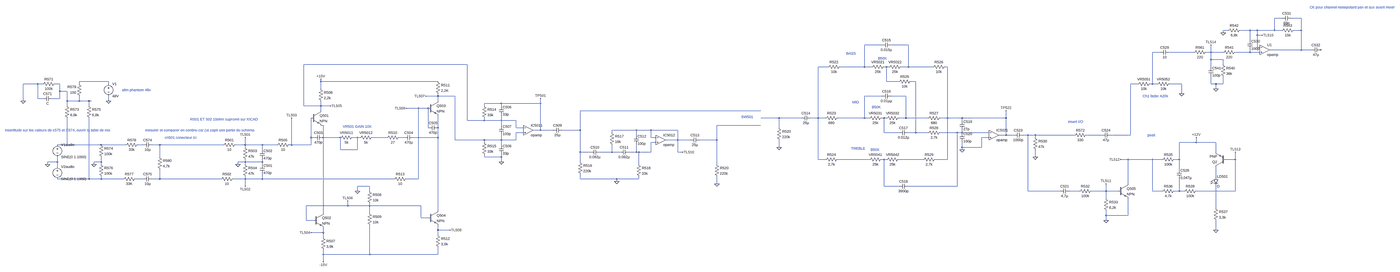
[diagram p0: schematic channelsimu.asc, whole sheet]
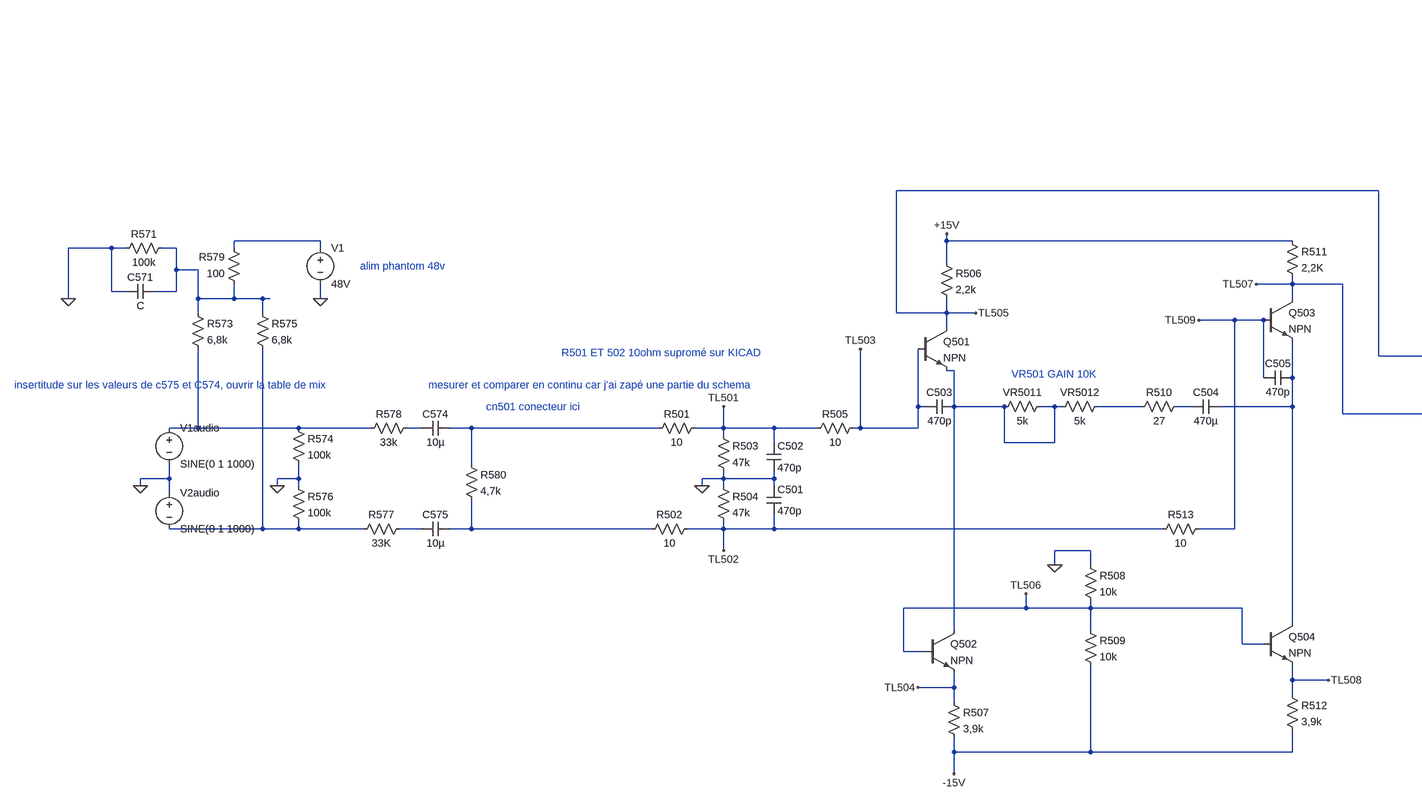
[diagram p1: schematic channelsimu.asc, part, row 1 of 1, column 1 of 3]
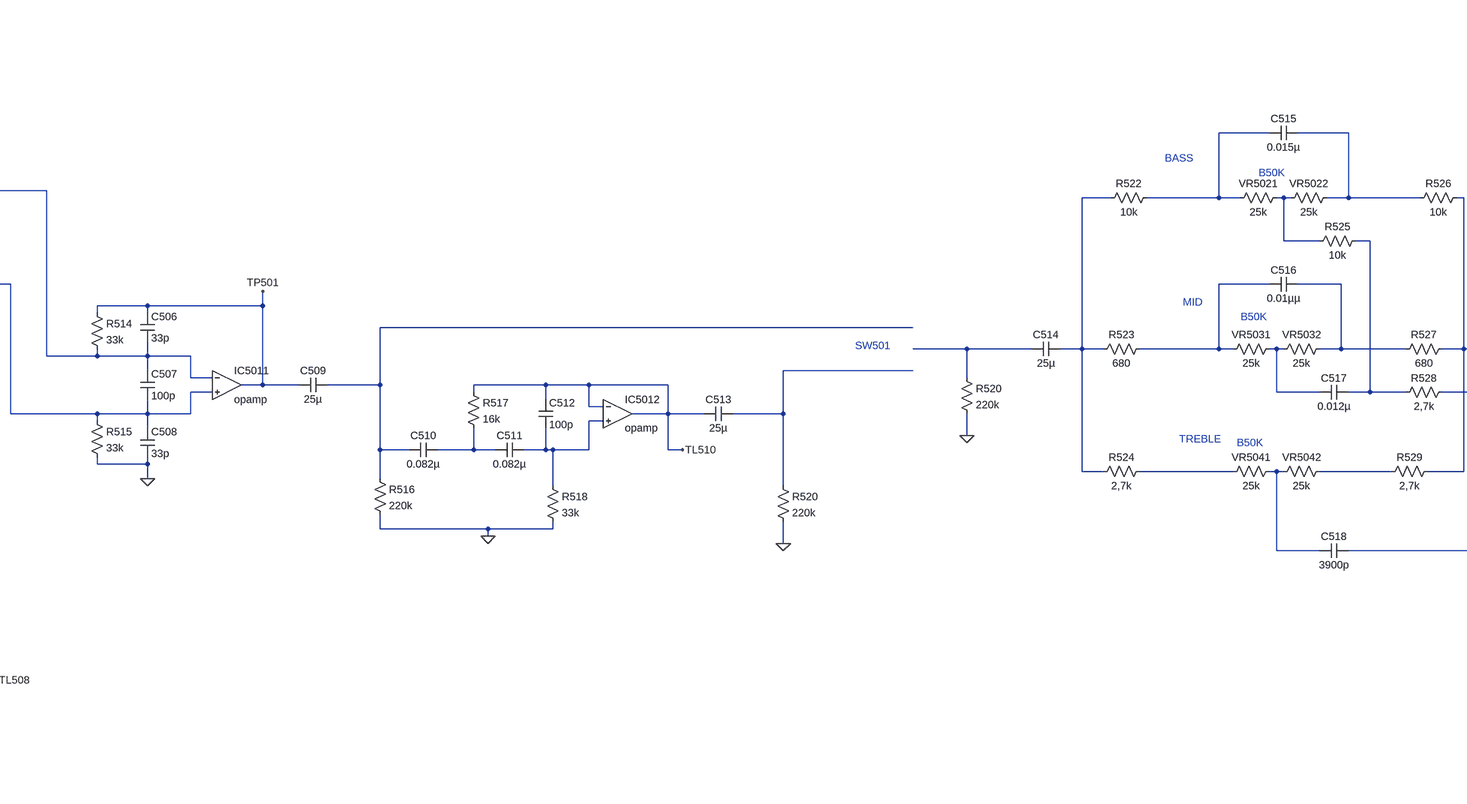
[diagram p2: schematic channelsimu.asc, part, row 1 of 1, column 2 of 3]
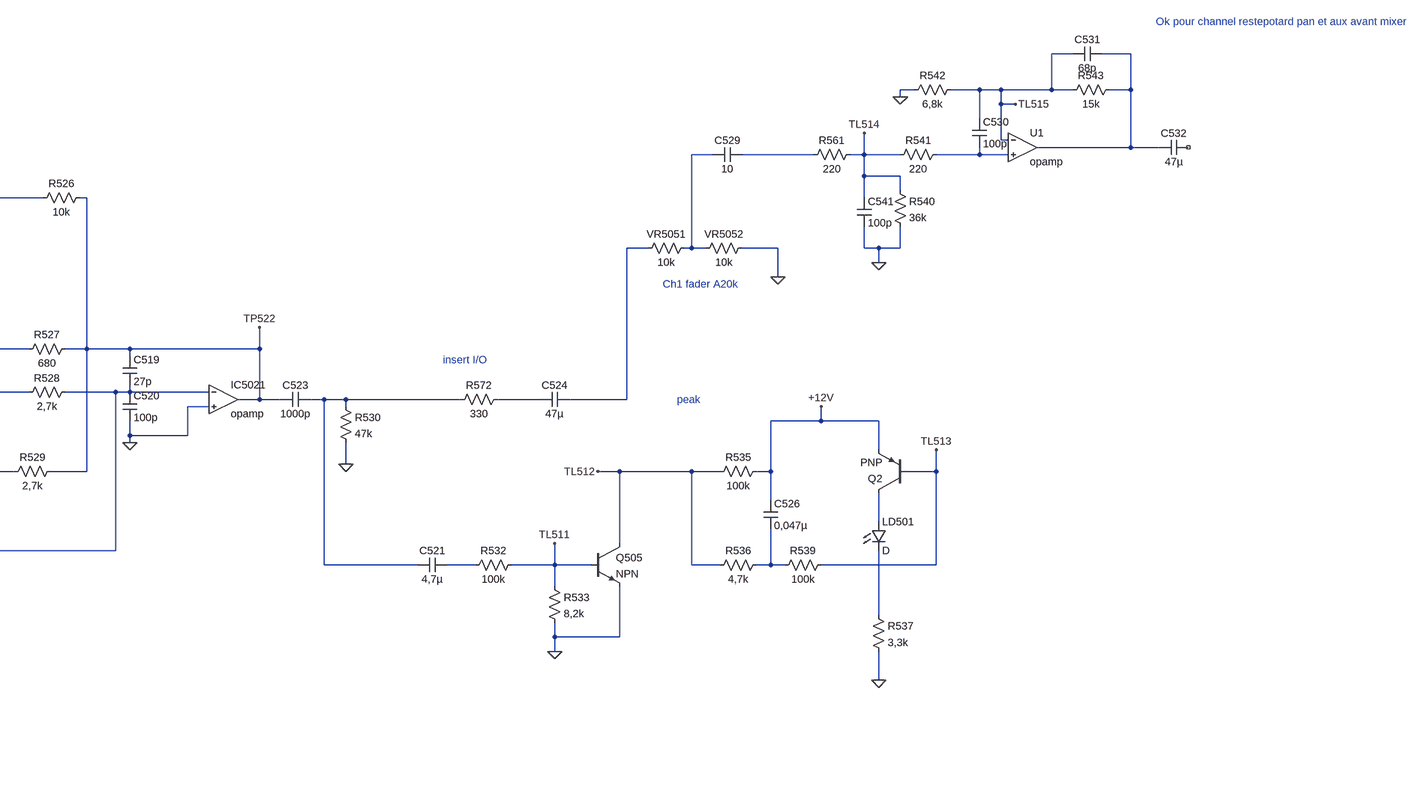
[diagram p3: schematic channelsimu.asc, part, row 1 of 1, column 3 of 3]
channelsimu.asc, the LTspice schematic file:
Version 4
SHEET 1 9212 964
WIRE 8416 -736 8368 -736
WIRE 8544 -736 8480 -736
WIRE 8064 -656 8032 -656
WIRE 8208 -656 8144 -656
WIRE 8256 -656 8208 -656
WIRE 8368 -656 8368 -736
WIRE 8368 -656 8256 -656
WIRE 8416 -656 8368 -656
WIRE 8544 -656 8544 -736
WIRE 8544 -656 8496 -656
WIRE 8032 -640 8032 -656
WIRE 8256 -624 8256 -656
WIRE 8288 -624 8256 -624
WIRE 8208 -592 8208 -656
WIRE 5792 -560 5680 -560
WIRE 5968 -560 5856 -560
WIRE 8256 -544 8256 -624
WIRE 8272 -544 8256 -544
WIRE 8544 -528 8544 -656
WIRE 8544 -528 8336 -528
WIRE 8608 -528 8544 -528
WIRE 7616 -512 7568 -512
WIRE 7840 -512 7680 -512
WIRE 7952 -512 7952 -560
WIRE 7952 -512 7920 -512
WIRE 8032 -512 7952 -512
WIRE 8208 -512 8208 -528
WIRE 8208 -512 8112 -512
WIRE 8272 -512 8208 -512
WIRE 7952 -464 7952 -512
WIRE 8032 -464 7952 -464
WIRE 2672 -432 1600 -432
WIRE 8032 -432 8032 -464
WIRE 5440 -416 5376 -416
WIRE 5680 -416 5680 -560
WIRE 5680 -416 5520 -416
WIRE 5728 -416 5680 -416
WIRE 5824 -416 5808 -416
WIRE 5840 -416 5824 -416
WIRE 5968 -416 5968 -560
WIRE 5968 -416 5920 -416
WIRE 6128 -416 5968 -416
WIRE 6224 -416 6208 -416
WIRE 7952 -416 7952 -464
WIRE 320 -320 128 -320
WIRE 1712 -320 1712 -336
WIRE 2480 -320 1712 -320
WIRE 5824 -320 5824 -416
WIRE 5904 -320 5824 -320
WIRE 6016 -320 5984 -320
WIRE -144 -304 -240 -304
WIRE -112 -304 -144 -304
WIRE 0 -304 -32 -304
WIRE 128 -304 128 -320
WIRE 320 -304 320 -320
WIRE 7472 -304 7424 -304
WIRE 7568 -304 7568 -512
WIRE 7568 -304 7552 -304
WIRE 7600 -304 7568 -304
WIRE 7760 -304 7680 -304
WIRE 7952 -304 7952 -352
WIRE 7984 -304 7952 -304
WIRE 8032 -304 8032 -352
WIRE 8032 -304 7984 -304
WIRE 1712 -272 1712 -320
WIRE 7984 -272 7984 -304
WIRE 0 -256 0 -304
WIRE 48 -256 0 -256
WIRE 7760 -240 7760 -304
WIRE 2480 -224 2480 -240
WIRE 2480 -224 2400 -224
WIRE 2592 -224 2480 -224
WIRE 5792 -224 5680 -224
WIRE 5952 -224 5856 -224
WIRE -144 -208 -144 -304
WIRE -112 -208 -144 -208
WIRE 0 -208 0 -256
WIRE 0 -208 -48 -208
WIRE -240 -192 -240 -304
WIRE 48 -192 48 -256
WIRE 128 -192 128 -224
WIRE 128 -192 48 -192
WIRE 192 -192 128 -192
WIRE 208 -192 192 -192
WIRE 320 -192 320 -224
WIRE 2480 -192 2480 -224
WIRE 2896 -176 2784 -176
WIRE 3152 -176 3152 -208
WIRE 3152 -176 2896 -176
WIRE 48 -160 48 -192
WIRE 192 -160 192 -192
WIRE 1600 -160 1600 -432
WIRE 1712 -160 1712 -192
WIRE 1712 -160 1600 -160
WIRE 1776 -160 1712 -160
WIRE 2784 -160 2784 -176
WIRE 2896 -160 2896 -176
WIRE 2352 -144 2272 -144
WIRE 2416 -144 2352 -144
WIRE 1712 -128 1712 -160
WIRE 4720 -128 3536 -128
WIRE 5120 -80 4720 -80
WIRE 5264 -80 5120 -80
WIRE 5376 -80 5376 -416
WIRE 5376 -80 5328 -80
WIRE 5424 -80 5376 -80
WIRE 5680 -80 5680 -224
WIRE 5680 -80 5504 -80
WIRE 5712 -80 5680 -80
WIRE 5808 -80 5792 -80
WIRE 5824 -80 5808 -80
WIRE 5952 -80 5952 -224
WIRE 5952 -80 5904 -80
WIRE 6096 -80 5952 -80
WIRE 6224 -80 6224 -416
WIRE 6224 -80 6176 -80
WIRE 6320 -80 6224 -80
WIRE 6608 -80 6608 -128
WIRE 6608 -80 6320 -80
WIRE 2672 -64 2672 -432
WIRE 2784 -64 2784 -80
WIRE 2784 -64 2672 -64
WIRE 2896 -64 2896 -96
WIRE 2896 -64 2784 -64
WIRE 2992 -64 2896 -64
WIRE 6320 -64 6320 -80
WIRE 1728 -32 1712 -32
WIRE 2896 -32 2896 -64
WIRE 4720 -32 4432 -32
WIRE 2416 -16 2416 -144
WIRE 2480 -16 2480 -96
WIRE 2992 -16 2992 -64
WIRE 3040 -16 2992 -16
WIRE 5120 -16 5120 -80
WIRE 3152 0 3152 -176
WIRE 3152 0 3104 0
WIRE 3232 0 3152 0
WIRE 3536 0 3536 -128
WIRE 3536 0 3296 0
WIRE 3904 0 3744 0
WIRE 4000 0 3904 0
WIRE 4176 0 4000 0
WIRE 3040 16 2992 16
WIRE 3744 16 3744 0
WIRE 5808 16 5808 -80
WIRE 5904 16 5808 16
WIRE 6016 16 6016 -320
WIRE 6016 16 5968 16
WIRE 6096 16 6016 16
WIRE 6288 16 6176 16
WIRE 6320 16 6320 0
WIRE 6320 16 6288 16
WIRE 6496 16 6320 16
WIRE 3904 32 3904 0
WIRE 6608 32 6608 -80
WIRE 6608 32 6560 32
WIRE 6656 32 6608 32
WIRE 6752 32 6720 32
WIRE 6800 32 6752 32
WIRE 7056 32 6800 32
WIRE 7232 32 7136 32
WIRE 7424 32 7424 -304
WIRE 7424 32 7296 32
WIRE 1648 48 1648 -80
WIRE 1664 48 1648 48
WIRE 1728 48 1728 -32
WIRE 1840 48 1728 48
WIRE 1952 48 1920 48
WIRE 1968 48 1952 48
WIRE 2144 48 2048 48
WIRE 2256 48 2224 48
WIRE 2480 48 2480 -16
WIRE 2480 48 2320 48
WIRE 4000 48 4000 0
WIRE 4032 48 4000 48
WIRE 6496 48 6448 48
WIRE 6800 48 6800 32
WIRE 2592 64 2592 -224
WIRE 2784 64 2592 64
WIRE 2896 64 2896 32
WIRE 2896 64 2784 64
WIRE 2992 64 2992 16
WIRE 2992 64 2896 64
WIRE 4176 64 4176 0
WIRE 4176 64 4096 64
WIRE 4256 64 4176 64
WIRE 4432 64 4432 -32
WIRE 4432 64 4320 64
WIRE 2784 80 2784 64
WIRE 4032 80 4000 80
WIRE 7856 80 7856 48
WIRE 7856 80 7744 80
WIRE 7984 80 7856 80
WIRE 48 96 48 -80
WIRE 48 96 -16 96
WIRE 272 96 48 96
WIRE 432 96 272 96
WIRE 544 96 512 96
WIRE 656 96 608 96
WIRE 1072 96 656 96
WIRE 1216 96 1216 48
WIRE 1216 96 1152 96
WIRE 1328 96 1216 96
WIRE 1424 96 1328 96
WIRE 1520 96 1520 -80
WIRE 1520 96 1504 96
WIRE 1648 96 1648 48
WIRE 1648 96 1520 96
WIRE 2896 96 2896 64
WIRE 1216 112 1216 96
WIRE 5120 112 5120 64
WIRE 6320 112 6320 80
WIRE 6448 112 6448 48
WIRE 6448 112 6320 112
WIRE 1328 128 1328 96
WIRE 1840 128 1840 48
WIRE 1952 128 1952 48
WIRE 1952 128 1840 128
WIRE 6320 128 6320 112
WIRE 3536 144 3536 0
WIRE 3600 144 3536 144
WIRE 3744 144 3744 96
WIRE 3744 144 3664 144
WIRE 3792 144 3744 144
WIRE 3904 144 3904 96
WIRE 3904 144 3856 144
WIRE 3920 144 3904 144
WIRE 4000 144 4000 80
WIRE 4000 144 3920 144
WIRE 4176 144 4176 64
WIRE 4208 144 4176 144
WIRE 7984 144 7984 80
WIRE 656 176 656 96
WIRE 2784 176 2784 160
WIRE 2896 176 2896 160
WIRE 2896 176 2784 176
WIRE 6800 176 6800 128
WIRE 5376 192 5376 -80
WIRE 5424 192 5376 192
WIRE 5712 192 5504 192
WIRE 5808 192 5792 192
WIRE 5824 192 5808 192
WIRE 6064 192 5904 192
WIRE 6224 192 6224 -80
WIRE 6224 192 6144 192
WIRE 7408 192 7360 192
WIRE 7568 192 7408 192
WIRE 7632 192 7568 192
WIRE 7744 192 7744 80
WIRE 7744 192 7712 192
WIRE 8112 192 8112 144
WIRE 8112 192 8048 192
WIRE -16 208 -16 176
WIRE -16 208 -80 208
WIRE 272 208 272 176
WIRE 272 208 224 208
WIRE 1216 208 1216 192
WIRE 1216 208 1168 208
WIRE 1328 208 1328 192
WIRE 1328 208 1216 208
WIRE 2896 208 2896 176
WIRE 3536 208 3536 144
WIRE -80 224 -80 208
WIRE 224 224 224 208
WIRE 272 224 272 208
WIRE 1168 224 1168 208
WIRE 1216 224 1216 208
WIRE 1328 224 1328 208
WIRE 3920 224 3920 144
WIRE 4432 224 4432 64
WIRE -16 240 -16 208
WIRE 7744 256 7744 192
WIRE 7984 304 7984 240
WIRE 192 320 192 -80
WIRE 192 320 -16 320
WIRE 272 320 272 304
WIRE 272 320 192 320
WIRE 416 320 272 320
WIRE 544 320 496 320
WIRE 656 320 656 256
WIRE 656 320 608 320
WIRE 1056 320 656 320
WIRE 1216 320 1216 304
WIRE 1216 320 1136 320
WIRE 1328 320 1328 288
WIRE 1328 320 1216 320
WIRE 2192 320 1328 320
WIRE 2352 320 2352 -144
WIRE 2352 320 2272 320
WIRE 3536 320 3536 288
WIRE 3776 320 3536 320
WIRE 3920 320 3920 304
WIRE 3920 320 3776 320
WIRE 3776 336 3776 320
WIRE 4432 352 4432 304
WIRE 7408 352 7408 192
WIRE 1216 368 1216 320
WIRE 2032 368 1952 368
WIRE 5808 368 5808 192
WIRE 5904 368 5808 368
WIRE 6288 368 6288 16
WIRE 6288 368 5968 368
WIRE 1952 400 1952 368
WIRE 2032 400 2032 368
WIRE 6752 400 6752 32
WIRE 6960 400 6752 400
WIRE 7088 400 7024 400
WIRE 7264 400 7264 352
WIRE 7264 400 7168 400
WIRE 7344 400 7264 400
WIRE 7568 400 7568 192
WIRE 7632 400 7568 400
WIRE 7744 400 7744 320
WIRE 7744 400 7712 400
WIRE 7776 400 7744 400
WIRE 8112 400 8112 192
WIRE 8112 400 7856 400
WIRE 7264 448 7264 400
WIRE 1888 496 1888 464
WIRE 1888 496 1616 496
WIRE 2032 496 2032 480
WIRE 2032 496 1888 496
WIRE 2368 496 2032 496
WIRE 7984 512 7984 368
WIRE 2480 528 2480 48
WIRE 1728 544 1728 48
WIRE 2032 544 2032 496
WIRE 7264 560 7264 528
WIRE 7408 560 7408 448
WIRE 7408 560 7264 560
WIRE 2368 576 2368 496
WIRE 2416 576 2368 576
WIRE 1616 592 1616 496
WIRE 1664 592 1616 592
WIRE 7264 592 7264 560
WIRE 2480 656 2480 624
WIRE 2560 656 2480 656
WIRE 7984 656 7984 592
WIRE 1728 672 1728 640
WIRE 1728 672 1648 672
WIRE 2480 688 2480 656
WIRE 1728 704 1728 672
WIRE 1728 816 1728 784
WIRE 2032 816 2032 624
WIRE 2032 816 1728 816
WIRE 2480 816 2480 768
WIRE 2480 816 2032 816
WIRE 1728 864 1728 816
FLAG -80 224 0
FLAG 224 224 0
FLAG 1168 224 0
FLAG 1216 48 TL501
FLAG 1216 368 TL502
FLAG 1520 -80 TL503
FLAG 1712 -336 +15V
FLAG 1728 864 -15V
FLAG 1952 400 0
FLAG 1776 -160 TL505
FLAG 2400 -224 TL507
FLAG 1648 672 TL504
FLAG 1888 464 TL506
FLAG 2560 656 TL508
FLAG 2272 -144 TL509
FLAG 2896 208 0
FLAG 3152 -208 TP501
FLAG 3776 336 0
FLAG 4432 352 0
FLAG 4208 144 TL510
FLAG 5120 112 0
FLAG 6320 128 0
FLAG 6608 -128 TP522
FLAG 6800 176 0
FLAG 7264 592 0
FLAG 7360 192 TL512
FLAG 8112 144 TL513
FLAG 7984 656 0
FLAG 7856 48 +12V
FLAG 7264 352 TL511
FLAG 7760 -240 0
FLAG 7984 -272 0
FLAG 7952 -560 TL514
FLAG 8032 -640 0
FLAG 8288 -624 TL515
FLAG -240 -192 0
FLAG 320 -192 0
SYMBOL voltage -16 80 R0
WINDOW 123 0 0 Left 0
WINDOW 39 0 0 Left 0
SYMATTR InstName V1audio
SYMATTR Value SINE(0 1 1000)
SYMBOL voltage -16 224 R0
WINDOW 123 0 0 Left 0
WINDOW 39 0 0 Left 0
SYMATTR InstName V2audio
SYMATTR Value SINE(0 1 1000)
SYMBOL res 256 80 R0
SYMATTR InstName R574
SYMATTR Value 100k
SYMBOL res 256 208 R0
SYMATTR InstName R576
SYMATTR Value 100k
SYMBOL res 528 80 R90
WINDOW 0 0 56 VBottom 2
WINDOW 3 32 56 VTop 2
SYMATTR InstName R578
SYMATTR Value 33k
SYMBOL res 512 304 R90
WINDOW 0 0 56 VBottom 2
WINDOW 3 32 56 VTop 2
SYMATTR InstName R577
SYMATTR Value 33K
SYMBOL cap 608 80 R90
WINDOW 0 0 32 VBottom 2
WINDOW 3 32 32 VTop 2
SYMATTR InstName C574
SYMATTR Value 10µ
SYMBOL cap 608 304 R90
WINDOW 0 0 32 VBottom 2
WINDOW 3 32 32 VTop 2
SYMATTR InstName C575
SYMATTR Value 10µ
SYMBOL res 640 160 R0
SYMATTR InstName R580
SYMATTR Value 4,7k
SYMBOL npn 1648 -128 R0
SYMATTR InstName Q501
SYMBOL npn 1664 544 R0
SYMATTR InstName Q502
SYMBOL npn 2416 -192 R0
SYMATTR InstName Q503
SYMBOL npn 2416 528 R0
SYMATTR InstName Q504
SYMBOL res 1168 80 R90
WINDOW 0 0 56 VBottom 2
WINDOW 3 32 56 VTop 2
SYMATTR InstName R501
SYMATTR Value 10
SYMBOL res 1152 304 R90
WINDOW 0 0 56 VBottom 2
WINDOW 3 32 56 VTop 2
SYMATTR InstName R502
SYMATTR Value 10
SYMBOL res 1200 96 R0
SYMATTR InstName R503
SYMATTR Value 47k
SYMBOL res 1200 208 R0
SYMATTR InstName R504
SYMATTR Value 47k
SYMBOL cap 1312 128 R0
SYMATTR InstName C502
SYMATTR Value 470p
SYMBOL cap 1312 224 R0
SYMATTR InstName C501
SYMATTR Value 470p
SYMBOL res 1520 80 R90
WINDOW 0 0 56 VBottom 2
WINDOW 3 32 56 VTop 2
SYMATTR InstName R505
SYMATTR Value 10
SYMBOL res 2288 304 R90
WINDOW 0 0 56 VBottom 2
WINDOW 3 32 56 VTop 2
SYMATTR InstName R513
SYMATTR Value 10
SYMBOL cap 1728 32 R90
WINDOW 0 0 32 VBottom 2
WINDOW 3 32 32 VTop 2
SYMATTR InstName C503
SYMATTR Value 470p
SYMBOL res 1696 -288 R0
SYMATTR InstName R506
SYMATTR Value 2,2k
SYMBOL res 1936 32 R90
WINDOW 0 0 56 VBottom 2
WINDOW 3 32 56 VTop 2
SYMATTR InstName VR5011
SYMATTR Value 5k
SYMBOL res 2064 32 R90
WINDOW 0 0 56 VBottom 2
WINDOW 3 32 56 VTop 2
SYMATTR InstName VR5012
SYMATTR Value 5k
SYMBOL res 2240 32 R90
WINDOW 0 0 56 VBottom 2
WINDOW 3 32 56 VTop 2
SYMATTR InstName R510
SYMATTR Value 27
SYMBOL cap 2320 32 R90
WINDOW 0 0 32 VBottom 2
WINDOW 3 32 32 VTop 2
SYMATTR InstName C504
SYMATTR Value 470µ
SYMBOL res 1712 688 R0
SYMATTR InstName R507
SYMATTR Value 3,9k
SYMBOL res 2016 528 R0
SYMATTR InstName R509
SYMATTR Value 10k
SYMBOL res 2016 384 R0
SYMATTR InstName R508
SYMATTR Value 10k
SYMBOL cap 2480 -32 R90
WINDOW 0 0 32 VBottom 2
WINDOW 3 32 32 VTop 2
SYMATTR InstName C505
SYMATTR Value 470p
SYMBOL res 2464 -336 R0
SYMATTR InstName R511
SYMATTR Value 2,2K
SYMBOL res 2464 672 R0
SYMATTR InstName R512
SYMATTR Value 3,9k
SYMBOL OpAmps\\opamp 3072 -64 R0
SYMATTR InstName IC5011
SYMBOL res 2768 -176 R0
SYMATTR InstName R514
SYMATTR Value 33k
SYMBOL res 2768 64 R0
SYMATTR InstName R515
SYMATTR Value 33k
SYMBOL cap 2880 -160 R0
SYMATTR InstName C506
SYMATTR Value 33p
SYMBOL cap 2880 -32 R0
SYMATTR InstName C507
SYMATTR Value 100p
SYMBOL cap 2880 96 R0
SYMATTR InstName C508
SYMATTR Value 33p
SYMBOL cap 3296 -16 R90
WINDOW 0 0 32 VBottom 2
WINDOW 3 32 32 VTop 2
SYMATTR InstName C509
SYMATTR Value 25µ
SYMBOL OpAmps\\opamp 4064 0 R0
SYMATTR InstName IC5012
SYMBOL res 3520 192 R0
SYMATTR InstName R516
SYMATTR Value 220k
SYMBOL res 3904 208 R0
SYMATTR InstName R518
SYMATTR Value 33k
SYMBOL res 4416 208 R0
SYMATTR InstName R520
SYMATTR Value 220k
SYMBOL res 3728 0 R0
SYMATTR InstName R517
SYMATTR Value 16k
SYMBOL cap 3664 128 R90
WINDOW 0 0 32 VBottom 2
WINDOW 3 32 32 VTop 2
SYMATTR InstName C510
SYMATTR Value 0.082µ
SYMBOL cap 3856 128 R90
WINDOW 0 0 32 VBottom 2
WINDOW 3 32 32 VTop 2
SYMATTR InstName C511
SYMATTR Value 0.082µ
SYMBOL cap 3888 32 R0
SYMATTR InstName C512
SYMATTR Value 100p
SYMBOL cap 4320 48 R90
WINDOW 0 0 32 VBottom 2
WINDOW 3 32 32 VTop 2
SYMATTR InstName C513
SYMATTR Value 25µ
SYMBOL res 5104 -32 R0
SYMATTR InstName R520
SYMATTR Value 220k
SYMBOL cap 5328 -96 R90
WINDOW 0 0 32 VBottom 2
WINDOW 3 32 32 VTop 2
SYMATTR InstName C514
SYMATTR Value 25µ
SYMBOL res 5536 -432 R90
WINDOW 0 0 56 VBottom 2
WINDOW 3 32 56 VTop 2
SYMATTR InstName R522
SYMATTR Value 10k
SYMBOL res 5520 -96 R90
WINDOW 0 0 56 VBottom 2
WINDOW 3 32 56 VTop 2
SYMATTR InstName R523
SYMATTR Value 680
SYMBOL res 5520 176 R90
WINDOW 0 0 56 VBottom 2
WINDOW 3 32 56 VTop 2
SYMATTR InstName R524
SYMATTR Value 2,7k
SYMBOL res 5824 -432 R90
WINDOW 0 0 56 VBottom 2
WINDOW 3 32 56 VTop 2
SYMATTR InstName VR5021
SYMATTR Value 25k
SYMBOL res 5936 -432 R90
WINDOW 0 0 56 VBottom 2
WINDOW 3 32 56 VTop 2
SYMATTR InstName VR5022
SYMATTR Value 25k
SYMBOL res 5808 -96 R90
WINDOW 0 0 56 VBottom 2
WINDOW 3 32 56 VTop 2
SYMATTR InstName VR5031
SYMATTR Value 25k
SYMBOL res 5920 -96 R90
WINDOW 0 0 56 VBottom 2
WINDOW 3 32 56 VTop 2
SYMATTR InstName VR5032
SYMATTR Value 25k
SYMBOL res 5808 176 R90
WINDOW 0 0 56 VBottom 2
WINDOW 3 32 56 VTop 2
SYMATTR InstName VR5041
SYMATTR Value 25k
SYMBOL res 5920 176 R90
WINDOW 0 0 56 VBottom 2
WINDOW 3 32 56 VTop 2
SYMATTR InstName VR5042
SYMATTR Value 25k
SYMBOL res 6224 -432 R90
WINDOW 0 0 56 VBottom 2
WINDOW 3 32 56 VTop 2
SYMATTR InstName R526
SYMATTR Value 10k
SYMBOL res 6192 -96 R90
WINDOW 0 0 56 VBottom 2
WINDOW 3 32 56 VTop 2
SYMATTR InstName R527
SYMATTR Value 680
SYMBOL res 6160 176 R90
WINDOW 0 0 56 VBottom 2
WINDOW 3 32 56 VTop 2
SYMATTR InstName R529
SYMATTR Value 2,7k
SYMBOL cap 5856 -576 R90
WINDOW 0 0 32 VBottom 2
WINDOW 3 32 32 VTop 2
SYMATTR InstName C515
SYMATTR Value 0.015µ
SYMBOL cap 5856 -240 R90
WINDOW 0 0 32 VBottom 2
WINDOW 3 32 32 VTop 2
SYMATTR InstName C516
SYMATTR Value 0.01µµ
SYMBOL cap 5968 352 R90
WINDOW 0 0 32 VBottom 2
WINDOW 3 32 32 VTop 2
SYMATTR InstName C518
SYMATTR Value 3900p
SYMBOL cap 5968 0 R90
WINDOW 0 0 32 VBottom 2
WINDOW 3 32 32 VTop 2
SYMATTR InstName C517
SYMATTR Value 0.012µ
SYMBOL res 6000 -336 R90
WINDOW 0 0 56 VBottom 2
WINDOW 3 32 56 VTop 2
SYMATTR InstName R525
SYMATTR Value 10k
SYMBOL OpAmps\\opamp 6528 -32 R0
SYMATTR InstName IC5021
SYMBOL res 6192 0 R90
WINDOW 0 0 56 VBottom 2
WINDOW 3 32 56 VTop 2
SYMATTR InstName R528
SYMATTR Value 2,7k
SYMBOL cap 6304 -64 R0
SYMATTR InstName C519
SYMATTR Value 27p
SYMBOL cap 6304 16 R0
SYMATTR InstName C520
SYMATTR Value 100p
SYMBOL cap 6720 16 R90
WINDOW 0 0 32 VBottom 2
WINDOW 3 32 32 VTop 2
SYMATTR InstName C523
SYMATTR Value 1000p
SYMBOL res 6784 32 R0
SYMATTR InstName R530
SYMATTR Value 47k
SYMBOL cap 7024 384 R90
WINDOW 0 0 32 VBottom 2
WINDOW 3 32 32 VTop 2
SYMATTR InstName C521
SYMATTR Value 4,7µ
SYMBOL res 7184 384 R90
WINDOW 0 0 56 VBottom 2
WINDOW 3 32 56 VTop 2
SYMATTR InstName R532
SYMATTR Value 100k
SYMBOL res 7248 432 R0
SYMATTR InstName R533
SYMATTR Value 8,2k
SYMBOL npn 7344 352 R0
SYMATTR InstName Q505
SYMBOL res 7872 384 R90
WINDOW 0 0 56 VBottom 2
WINDOW 3 32 56 VTop 2
SYMATTR InstName R539
SYMATTR Value 100k
SYMBOL res 7728 384 R90
WINDOW 0 0 56 VBottom 2
WINDOW 3 32 56 VTop 2
SYMATTR InstName R536
SYMATTR Value 4,7k
SYMBOL pnp 8048 240 R180
SYMATTR InstName Q2
SYMBOL res 7728 176 R90
WINDOW 0 0 56 VBottom 2
WINDOW 3 32 56 VTop 2
SYMATTR InstName R535
SYMATTR Value 100k
SYMBOL cap 7728 256 R0
SYMATTR InstName C526
SYMATTR Value 0,047µ
SYMBOL res 7968 496 R0
SYMATTR InstName R537
SYMATTR Value 3,3k
SYMBOL LED 7968 304 R0
SYMATTR InstName LD501
SYMBOL res 7152 16 R90
WINDOW 0 0 56 VBottom 2
WINDOW 3 32 56 VTop 2
SYMATTR InstName R572
SYMATTR Value 330
SYMBOL cap 7296 16 R90
WINDOW 0 0 32 VBottom 2
WINDOW 3 32 32 VTop 2
SYMATTR InstName C524
SYMATTR Value 47µ
SYMBOL res 7568 -320 R90
WINDOW 0 0 56 VBottom 2
WINDOW 3 32 56 VTop 2
SYMATTR InstName VR5051
SYMATTR Value 10k
SYMBOL res 7696 -320 R90
WINDOW 0 0 56 VBottom 2
WINDOW 3 32 56 VTop 2
SYMATTR InstName VR5052
SYMATTR Value 10k
SYMBOL cap 7680 -528 R90
WINDOW 0 0 32 VBottom 2
WINDOW 3 32 32 VTop 2
SYMATTR InstName C529
SYMATTR Value 10
SYMBOL res 7936 -528 R90
WINDOW 0 0 56 VBottom 2
WINDOW 3 32 56 VTop 2
SYMATTR InstName R561
SYMATTR Value 220
SYMBOL res 8128 -528 R90
WINDOW 0 0 56 VBottom 2
WINDOW 3 32 56 VTop 2
SYMATTR InstName R541
SYMATTR Value 220
SYMBOL cap 7936 -416 R0
SYMATTR InstName C541
SYMATTR Value 100p
SYMBOL res 8016 -448 R0
SYMATTR InstName R540
SYMATTR Value 36k
SYMBOL OpAmps\\opamp 8304 -592 R0
SYMATTR InstName U1
SYMBOL res 8160 -672 R90
WINDOW 0 0 56 VBottom 2
WINDOW 3 32 56 VTop 2
SYMATTR InstName R542
SYMATTR Value 6,8k
SYMBOL cap 8192 -592 R0
SYMATTR InstName C530
SYMATTR Value 100p
SYMBOL res 8512 -672 R90
WINDOW 0 0 56 VBottom 2
WINDOW 3 32 56 VTop 2
SYMATTR InstName R543
SYMATTR Value 15k
SYMBOL cap 8480 -752 R90
WINDOW 0 0 32 VBottom 2
WINDOW 3 32 32 VTop 2
SYMATTR InstName C531
SYMATTR Value 68p
SYMBOL cap 8672 -544 R90
WINDOW 0 0 32 VBottom 2
WINDOW 3 32 32 VTop 2
SYMATTR InstName C532
SYMATTR Value 47µ
SYMBOL res 176 -176 R0
SYMATTR InstName R575
SYMATTR Value 6,8k
SYMBOL res 32 -176 R0
SYMATTR InstName R573
SYMATTR Value 6,8k
SYMBOL res 144 -208 R180
WINDOW 0 36 76 Left 2
WINDOW 3 36 40 Left 2
SYMATTR InstName R579
SYMATTR Value 100
SYMBOL res -128 -288 R270
WINDOW 0 32 56 VTop 2
WINDOW 3 0 56 VBottom 2
SYMATTR InstName R571
SYMATTR Value 100k
SYMBOL cap -48 -224 R90
WINDOW 0 0 32 VBottom 2
WINDOW 3 32 32 VTop 2
SYMATTR InstName C571
SYMBOL voltage 320 -320 R0
WINDOW 123 0 0 Left 0
WINDOW 39 0 0 Left 0
SYMATTR InstName V1
SYMATTR Value 48V
TEXT -360 0 Left 2 ;insertitude sur les valeurs de c575 et C574, ouvrir la table de mix
TEXT 688 48 Left 2 ;cn501 conecteur ici
TEXT 560 0 Left 2 ;mesurer et comparer en continu car j'ai zapé une partie du schema
TEXT 1856 -24 Left 2 ;VR501 GAIN 10K
TEXT 4592 -88 Left 2 ;SW501
TEXT 5560 -504 Left 2 ;BASS
TEXT 5600 -184 Left 2 ;MID
TEXT 5592 120 Left 2 ;TREBLE
TEXT 5768 -472 Left 2 ;B50K
TEXT 5728 -152 Left 2 ;B50K
TEXT 5720 128 Left 2 ;B50K
TEXT 7536 32 Left 2 ;peak
TEXT 7016 -56 Left 2 ;insert I/O
TEXT 7504 -224 Left 2 ;Ch1 fader A20k
TEXT 8600 -808 Left 2 ;Ok pour channel restepotard pan et aux avant mixer
TEXT 856 -72 Left 2 ;R501 ET 502 10ohm supromé sur KICAD
TEXT 408 -264 Left 2 ;alim phantom 48v

The netlist it stands for:
* channelsimu.asc
V1audio N027 0 SINE(0 1 1000)
V2audio 0 N035 SINE(0 1 1000)
R574 N027 0 100k
R576 0 N035 100k
R578 N028 N027 33k
R577 N036 N035 33K
C574 N029 N028 10µ
C575 N037 N036 10µ
R580 N029 N037 4,7k
Q501 TL505 TL503 N018 0 NPN
Q502 N018 TL506 TL504 0 NPN
Q503 TL507 TL509 N020 0 NPN
Q504 N020 TL506 TL508 0 NPN
R501 TL501 N029 10
R502 TL502 N037 10
R503 TL501 0 47k
R504 0 TL502 47k
C502 TL501 0 470p
C501 0 TL502 470p
R505 TL503 TL501 10
R513 TL509 TL502 10
C503 N018 TL503 470p
R506 +15V TL505 2,2k
R§VR5011 N018 N018 5k
R§VR5012 N024 N018 5k
R510 N025 N024 27
C504 N020 N025 470µ
R507 TL504 -15V 3,9k
R509 TL506 -15V 10k
R508 0 TL506 10k
C505 N020 TL509 470p
R511 +15V TL507 2,2K
R512 TL508 -15V 3,9k
XIC5011 TL505 TL507 TP501 opamp Aol=100K GBW=10Meg  ; pins invin noninvin out
R514 TP501 TL505 33k
R515 TL507 0 33k
C506 TP501 TL505 33p
C507 TL505 TL507 100p
C508 TL507 0 33p
C509 N015 TP501 25µ
XIC5012 TL510 N026 TL510 opamp Aol=100K GBW=10Meg  ; pins invin noninvin out
R516 N015 0 220k
R518 N026 0 33k
R520 N019 0 220k
R517 TL510 N030 16k
C510 N030 N015 0.082µ
C511 N026 N030 0.082µ
C512 TL510 N026 100p
C513 N019 TL510 25µ
R520 N016 0 220k
C514 N007 N016 25µ
R522 N002 N007 10k
R523 N013 N007 680
R524 N031 N007 2,7k
R§VR5021 N008 N002 25k
R§VR5022 N003 N008 25k
R§VR5031 N017 N013 25k
R§VR5032 N014 N017 25k
R§VR5041 N032 N031 25k
R§VR5042 N033 N032 25k
R526 TP522 N003 10k
R527 TP522 N014 680
R529 TP522 N033 2,7k
C515 N003 N002 0.015µ
C516 N014 N013 0.01µµ
C518 N021 N032 3900p
C517 N010 N017 0.012µ
R525 N010 N008 10k
XIC5021 N021 0 TP522 opamp Aol=100K GBW=10Meg  ; pins invin noninvin out
R528 N021 N010 2,7k
C519 TP522 N021 27p
C520 N021 0 100p
C523 N022 TP522 1000p
R530 N022 0 47k
C521 N038 N022 4,7µ
R532 TL511 N038 100k
R533 TL511 0 8,2k
Q505 TL512 TL511 0 0 NPN
R539 TL513 N039 100k
R536 N039 TL512 4,7k
Q2 N034 TL513 +12V 0 PNP
R535 +12V TL512 100k
C526 +12V N039 0,047µ
R537 N040 0 3,3k
D§LD501 N034 N040 D
R572 N023 N022 330
C524 N012 N023 47µ
R§VR5051 N004 N012 10k
R§VR5052 0 N004 10k
C529 N005 N004 10
R561 TL514 N005 220
R541 N006 TL514 220
C541 TL514 0 100p
R540 TL514 0 36k
XU1 TL515 N006 N001 opamp Aol=100K GBW=10Meg  ; pins invin noninvin out
R542 TL515 0 6,8k
C530 TL515 N006 100p
R543 N001 TL515 15k
C531 N001 TL515 68p
C532 NC_01 N001 47µ
R575 N011 N035 6,8k
R573 N011 N027 6,8k
R579 N011 N009 100
R571 0 N011 100k
C571 N011 0 C
V1 N009 0 48V
.model D D
.lib standard.dio
.model NPN NPN
.model PNP PNP
.lib standard.bjt
* insertitude sur les valeurs de c575 et C574, ouvrir la table de mix
* cn501 conecteur ici
* mesurer et comparer en continu car j'ai zapé une partie du schema
* VR501 GAIN 10K
* SW501
* BASS
* MID
* TREBLE
* B50K
* B50K
* B50K
* peak
* insert I/O
* Ch1 fader A20k
* Ok pour channel restepotard pan et aux avant mixer
* R501 ET 502 10ohm supromé sur KICAD
* alim phantom 48v
.backanno
.end